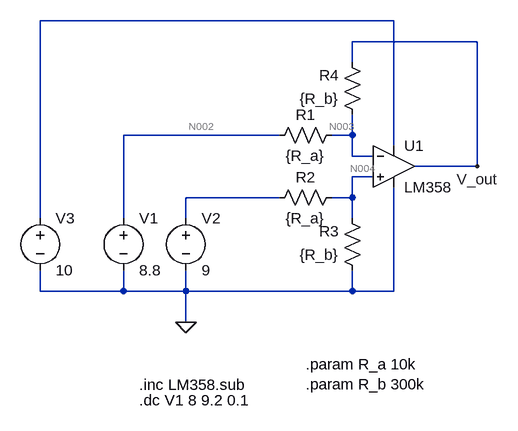
[diagram p0: schematic Draft1.asc]
Draft1.asc, the LTspice schematic file:
Version 4
SHEET 1 880 680
WIRE 384 48 -160 48
WIRE 512 80 320 80
WIRE 320 112 320 80
WIRE 208 224 -32 224
WIRE 320 224 320 192
WIRE 320 224 288 224
WIRE 384 240 384 48
WIRE 320 256 320 224
WIRE 352 256 320 256
WIRE 512 272 512 80
WIRE 512 272 416 272
WIRE 352 288 320 288
WIRE 208 320 64 320
WIRE 320 320 320 288
WIRE 320 320 288 320
WIRE -160 352 -160 48
WIRE -32 352 -32 224
WIRE 64 352 64 320
WIRE 320 352 320 320
WIRE -160 464 -160 432
WIRE -32 464 -32 432
WIRE -32 464 -160 464
WIRE 64 464 64 432
WIRE 64 464 -32 464
WIRE 320 464 320 432
WIRE 320 464 64 464
WIRE 384 464 384 304
WIRE 384 464 320 464
WIRE 64 512 64 464
FLAG 64 512 0
FLAG 512 272 V_out
SYMBOL Opamps/opamp2 384 208 R0
SYMATTR InstName U1
SYMATTR Value LM358
SYMBOL voltage -32 336 R0
SYMATTR InstName V1
SYMATTR Value 8.8
SYMBOL res 304 208 R90
WINDOW 0 0 56 VBottom 2
WINDOW 3 32 56 VTop 2
SYMATTR InstName R1
SYMATTR Value {R_a}
SYMBOL res 304 304 R90
WINDOW 0 0 56 VBottom 2
WINDOW 3 32 56 VTop 2
SYMATTR InstName R2
SYMATTR Value {R_a}
SYMBOL res 336 448 R180
WINDOW 0 36 76 Left 2
WINDOW 3 36 40 Left 2
SYMATTR InstName R3
SYMATTR Value {R_b}
SYMBOL res 336 208 R180
WINDOW 0 36 76 Left 2
WINDOW 3 36 40 Left 2
SYMATTR InstName R4
SYMATTR Value {R_b}
SYMBOL voltage 64 336 R0
SYMATTR InstName V2
SYMATTR Value 9
SYMBOL voltage -160 336 R0
SYMATTR InstName V3
SYMATTR Value 10
TEXT -8 608 Left 2 !.inc LM358.sub
TEXT 248 576 Left 2 !.param R_a 10k\n.param R_b 300k
TEXT -8 632 Left 2 !.dc V1 8 9.2 0.1

The netlist it stands for:
* Draft1.asc
XU1 N004 N003 N001 0 V_out LM358  ; pins In+ In- V+ V- OUT
V1 N002 0 8.8
R1 N003 N002 {R_a}
R2 N004 N005 {R_a}
R3 0 N004 {R_b}
R4 N003 V_out {R_b}
V2 N005 0 9
V3 N001 0 10
.inc LM358.sub
.param R_a 10k
.param R_b 300k
.dc V1 8 9.2 0.1
.backanno
.end

* Results of the author's LTspice run, read from the files saved beside the schematic
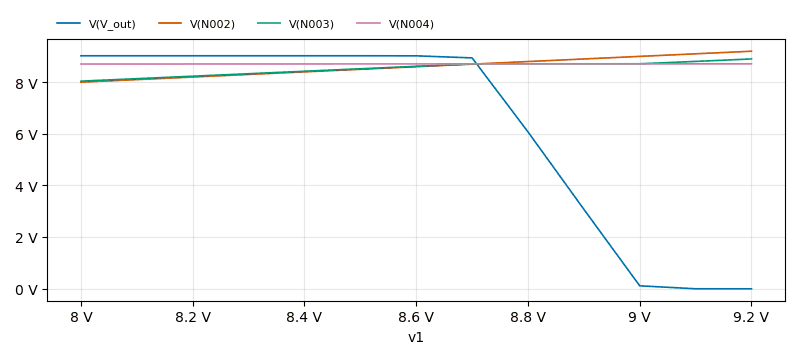
[diagram p1: DC transfer characteristic of Draft1.asc, plotted from the saved traces]
* DC transfer characteristic, 1 run:
*   V(V_out): 9.024 V at v1=8 V, -9.276 mV at v1=9.2 V, min -9.276 mV, max 9.024 V
*   V(N002): 8 V at v1=8 V, 9.2 V at v1=9.2 V, min 8 V, max 9.2 V
*   V(N003): 8.04 V at v1=8 V, 8.901 V at v1=9.2 V, min 8.04 V, max 8.901 V
*   V(N004): 8.703 V at v1=8 V, 8.712 V at v1=9.2 V, min 8.703 V, max 8.712 V